# Altium schematic sheet nfc-epd-mcu.SchDoc
size Letter
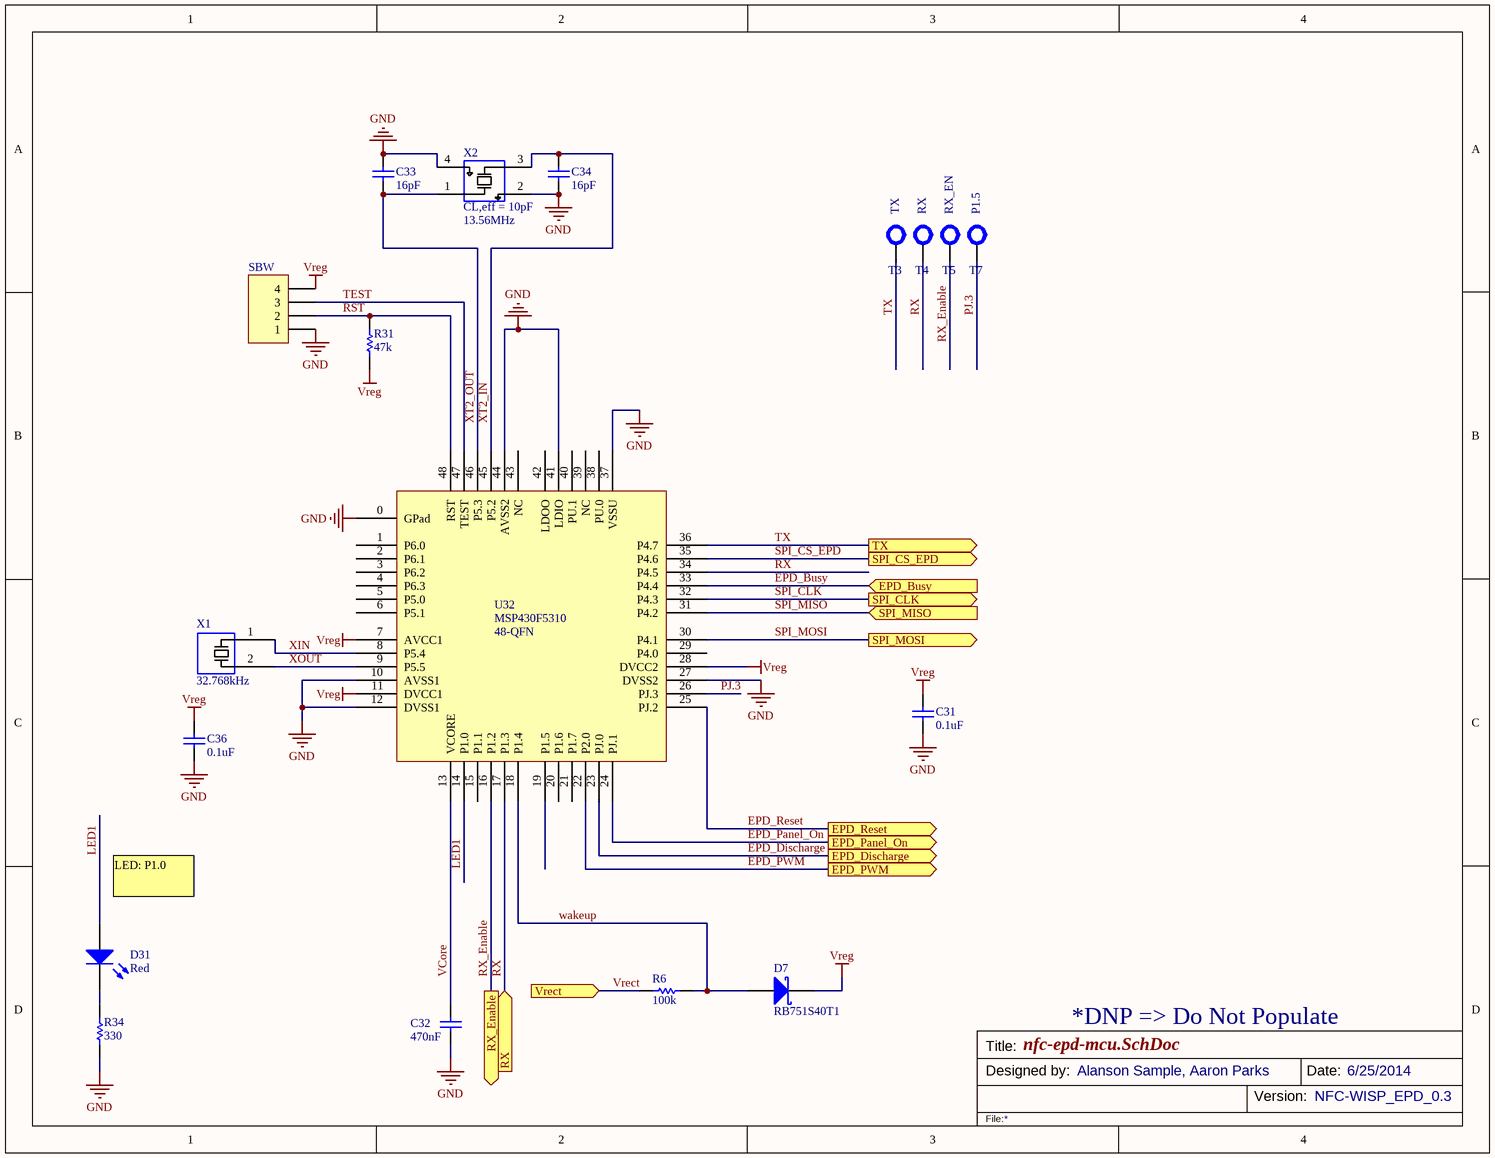
[diagram p0: nfc-epd-mcu.SchDoc]

## Parts
C31  value 0.1uF  [0402]  (hidden comment: Cap)
C32  value 470nF  [0402]  (hidden comment: Cap)
C33  value 16pF  [0402]  (hidden comment: Cap)
C34  value 16pF  [0402]  (hidden comment: Cap)
C36  value 0.1uF  [0402]  (hidden comment: Cap)
D7  RB751S40T1  [SOD-523]
D31  value Red  [Diode - 0603]  (hidden comment: LED)
R6  value 100k  [0402]  (hidden comment: Res)
R31  value 47k  [0402]  (hidden comment: Res)
R34  value 330  [0402]  (hidden comment: Res)
SBW  MHDR1X4  [MHDR1X4]  (value not drawn)
T3  Note: TX  [Test Point - Super Small]  (hidden comment: Test Point)
T4  Note: RX  [Test Point - Super Small]  (hidden comment: Test Point)
T5  Note: RX_EN  [Test Point - Super Small]  (hidden comment: Test Point)
T7  Note: P1.5  [Test Point - Super Small]  (hidden comment: Test Point)
U32  MSP430F5310  [48-QFN]
X1  value 32.768kHz  [XTAL - 2Pin [3.2mm x 1.5mm]]  (hidden comment: XTAL)
X2  value 13.56MHz  Rating: CL,eff = 10pF  [XTAL - 4Pin [3.2MM X 2.5MM]]  (hidden comment: XTAL 4pin)

## Ports
EPD_Busy (in), EPD_Discharge (out), EPD_Panel_On (out), EPD_PWM (out), EPD_Reset (out), RX (in), RX_Enable (out), SPI_CLK (out), SPI_CS_EPD (out), SPI_MISO (in), SPI_MOSI (out), TX (out), Vrect (in)

## Nets
GND: C31.1 C32.2 C33.2 C34.1 C36.1 R34.1 SBW.1 U32.0(GPad) U32.10(AVSS1) U32.12(DVSS1) U32.27(DVSS2) U32.37(VSSU) U32.41(LDIO) U32.44(AVSS2) X2.2(Gnd) X2.4(Gnd)
Vreg: C31.2 C36.2 D7.2(C) R31.2 SBW.4 U32.7(AVCC1) U32.11(DVCC1) U32.28(DVCC2)
EPD_Busy: U32.33(P4.4) ; port EPD_Busy
EPD_Discharge: U32.23(PJ.0) ; port EPD_Discharge
EPD_Panel_On: U32.24(PJ.1) ; port EPD_Panel_On
EPD_PWM: U32.22(P2.0) ; port EPD_PWM
EPD_Reset: U32.25(PJ.2) ; port EPD_Reset
LED1: D31.1(A) U32.14(P1.0)
PJ.3: T7.0 U32.26(PJ.3)
RST: R31.1 SBW.2 U32.48(RST)
RX: T4.0 U32.17(P1.3) U32.34(P4.5) ; port RX
RX_Enable: T5.0 U32.16(P1.2) ; port RX_Enable
SPI_CLK: U32.32(P4.3) ; port SPI_CLK
SPI_CS_EPD: U32.35(P4.6) ; port SPI_CS_EPD
SPI_MISO: U32.31(P4.2) ; port SPI_MISO
SPI_MOSI: U32.30(P4.1) ; port SPI_MOSI
TEST: SBW.3 U32.47(TEST)
TX: T3.0 U32.36(P4.7) ; port TX
VCore: C32.1 U32.13(VCORE)
Vrect: R6.1 ; port Vrect
wakeup: D7.1(A) R6.2 U32.18(P1.4)
XIN: U32.8(P5.4) X1.1
XOUT: U32.9(P5.5) X1.2
XT2_IN: C34.2 U32.45(P5.2) X2.3(XOUT)
XT2_OUT: C33.1 U32.46(P5.3) X2.1(XIN)
NetD31_2: D31.2(K) R34.2

Not connected (* = marked no-connect by the designer): U32 1(P6.0) 2(P6.1) 3(P6.2) 4(P6.3) 5(P5.0) 6(P5.1) 15(P1.1) 19(P1.5) 20(P1.6) 21(P1.7) 29(P4.0) 38(PU.0) 39(NC) 40(PU.1) 42(LDOO) 43(NC)

## Notes on the sheet
- LED: P1.0
- *DNP => Do Not Populate
- Title:
- Designed by:
- Alanson Sample, Aaron Parks
- Version:
- Date:
- NFC-WISP_EPD_0.3
- 6/25/2014
- File:

## Library data of the parts
C31-C34 C36 = Cap: Ceramic Capacitor (Surface Mount); Manufacturer: Generic Ceramic Chip Cap (TBD); Digi-Key Part Number: *; Manufacturer Part Number: *; Note: *; Rating: *
D7 = RB751S40T1: Schottky Diode; Published: 8-Jun-2000; LatestRevisionDate: 17-Jul-2002; LatestRevisionNote: Re-released for DXP Platform.; PackageReference: SMB; Publisher: Altium Limited; Code_JEDEC: DO-214-AA
D31 = Diode - LED: Typical RED, GREEN, YELLOW, AMBER GaAs LED; Digi-Key Part Number: *; Manufacturer: *; Manufacturer Part Number: *; Note: *; Rating: *
R6 R31 R34 = Res: Chip Resistor (Surface Mount); Manufacturer: Generic Chip Res (TBD); Manufacturer Part Number: *; Digi-Key Part Number: *; Rating: *
  R6: Note: *
SBW = MHDR1X4: Header, 4-Pin; LatestRevisionDate: 17-Jul-2002; LatestRevisionNote: Re-released for DXP Platform.; Publisher: Altium Limited
T3-T5 T7 = Test Point: Test Point, large or small foot prints; Manufacturer Part Number: Example: 5000, 5013; Manufacturer: Keystone Electronics; Digi-Key Part Number: Example: 5000K-ND, 5012K-ND, Surface mount 5015KCT-ND; Rating: *; Value: *
U32 = MSP430F5310 - 48Pin: MSP430 - 48LQFP or 48QFN; Manufacturer: Texas Instruments; Manufacturer Part Number: MSP430F5310 (IPTR or IRGZ); Digi-Key Part Number: 296-28193-2-ND or 296-28133-1-ND; Rating: *; Value: *; Note: 48-QFN
X1 = XTAL 2-pins: Crystal Oscillator - [3.20mm x 1.50mm]; Manufacturer: Epson Toyocom Corporation; Manufacturer Part Number: FC-135 32.7680KA-A3; Digi-Key Part Number: example: SE2413CT-ND
X2 = XTAL 4-pins: Crystal - 4-Pin Surface Mount; Manufacturer Part Number: ABM8G-13.560MHZ-B4Y-T; Manufacturer: Abracon Corporation; Digi-Key Part Number: 535-10286-1-ND